# Altium schematic sheet WindCharger.SchDoc
size A4
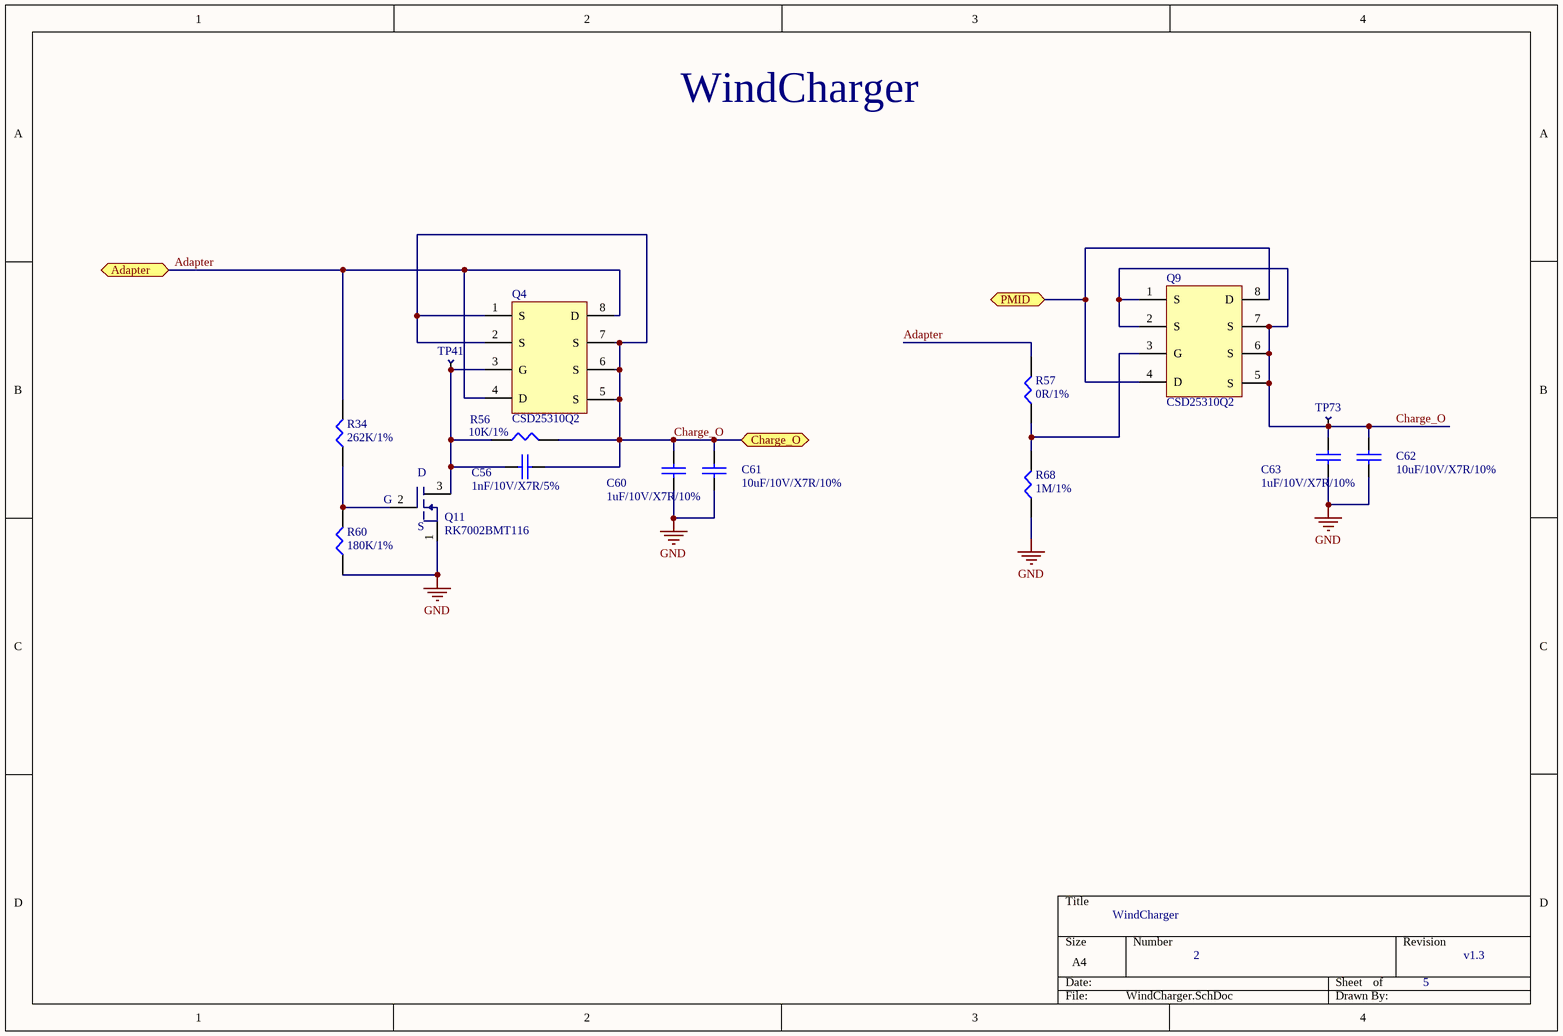
[diagram p0: WindCharger.SchDoc]

## Parts
C56  1nF/10V/X7R/5%  [0402C]
C60  1uF/10V/X7R/10%  [0402C]
C61  10uF/10V/X7R/10%  [0603C]
C62  10uF/10V/X7R/10%  [0603C]
C63  1uF/10V/X7R/10%  [0402C]
Q4  CSD25310Q2  [DQK]
Q9  CSD25310Q2  [DQK]
Q11  RK7002BMT116  [SOT23]
R34  262K/1%  [0402R]
R56  10K/1%  [0402R]
R57  0R/1%  [0402R]
R60  180K/1%  [0402R]
R68  1M/1%  [0402R]
TP41  TEST  [Test Pad]  (value not drawn)
TP73  TEST  [Test Pad]  (value not drawn)

## Ports
Adapter (bidir), Charge_O (bidir), PMID (bidir)

## Nets
GND: C60.2 C61.2 C62.2 C63.2 Q11.1(S) R60.1 R68.1
Adapter: Q4.4(D) Q4.8(D) R34.2 R57.2 ; port Adapter
Charge_O: C56.2 C60.1 C61.1 C62.1 C63.1 Q4.1(S) Q4.2(S) Q4.5(S) Q4.6(S) Q4.7(S) Q9.1(S) Q9.2(S) Q9.5(S) Q9.6(S) Q9.7(S) R56.2 TP73.1 ; port Charge_O
PMID: Q9.4(D) Q9.8(D) ; port PMID
NetC56_1: C56.1 Q4.3(G) Q11.3(D) R56.1 TP41.1
NetQ9_3: Q9.3(G) R57.1 R68.2
NetQ11_2: Q11.2(G) R34.1 R60.2

## Notes on the sheet
- WindCharger
- 2
- 5
- v1.3

## Library data of the parts
C56 = CAP: 厂家：Murata，型号：GRM1555C1H102JA01D
C60 C63 = CAP: 厂家：Murata，型号：GRM155R61C105KA12D
C61 C62 = CAP: 厂家：Murata，型号：GRM188R61A106KE69D
Q4 Q9 = CSD25310Q2: 厂家：TI，型号：   CSD25310Q2
Q11 = RK7002: 厂家：Vishay，型号：RK7002BMT116
R34 = RES1: 厂家：Yageo，型号：RC0402FR-07262KL
R56 = RES1: 厂家：Yageo，型号：RC0402FR-0710KL
R57 R68 = RES1: 厂家：Yageo，型号：RC0402FR-071ML
R60 = RES1: 厂家：Yageo，型号：RC0402FR-07180KL
TP41 TP73 = TEST: Test Point